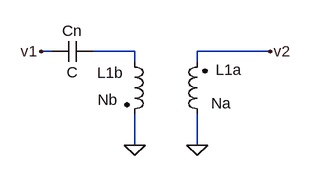
[diagram p0: schematic circuito_AC_b.asc]
circuito_AC_b.asc, the LTspice schematic file:
Version 4
SHEET 1 880 680
WIRE 80 64 64 64
WIRE 208 64 144 64
WIRE 416 64 304 64
WIRE 208 80 208 64
WIRE 304 80 304 64
WIRE 208 208 208 160
WIRE 304 208 304 160
FLAG 208 208 0
FLAG 304 208 0
FLAG 64 64 v1
FLAG 416 64 v2
SYMBOL ind2 320 176 R180
WINDOW 0 -53 84 Left 2
WINDOW 3 -36 32 Left 2
SYMATTR InstName L1a
SYMATTR Value Na
SYMATTR Type ind
SYMBOL ind2 192 64 R0
WINDOW 0 -42 33 Left 2
WINDOW 3 -41 74 Left 2
SYMATTR InstName L1b
SYMATTR Value Nb
SYMATTR Type ind
SYMBOL cap 144 48 R90
WINDOW 0 0 32 VBottom 2
WINDOW 3 32 32 VTop 2
SYMATTR InstName Cn

The netlist it stands for:
* circuito_AC_b.asc
L1a 0 v2 Na
L1b N001 0 Nb
Cn N001 v1 C
.backanno
.end